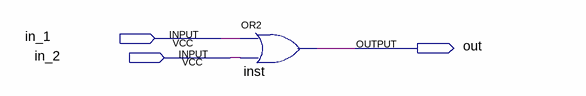
[diagram p0: schematic sheet]
// Quartus schematic or_gate.bdf as structural Verilog: 1 symbols, 3 pins
module or_gate (
  input  in_1,
  input  in_2,
  output out
);

  or inst (out, in_1, in_2);
endmodule
